# Altium schematic sheet [10] - DOC REVISION HISTORY.SchDoc
size A3; DocumentNumber: 10; SheetNumber: 10; SheetTotal: 11
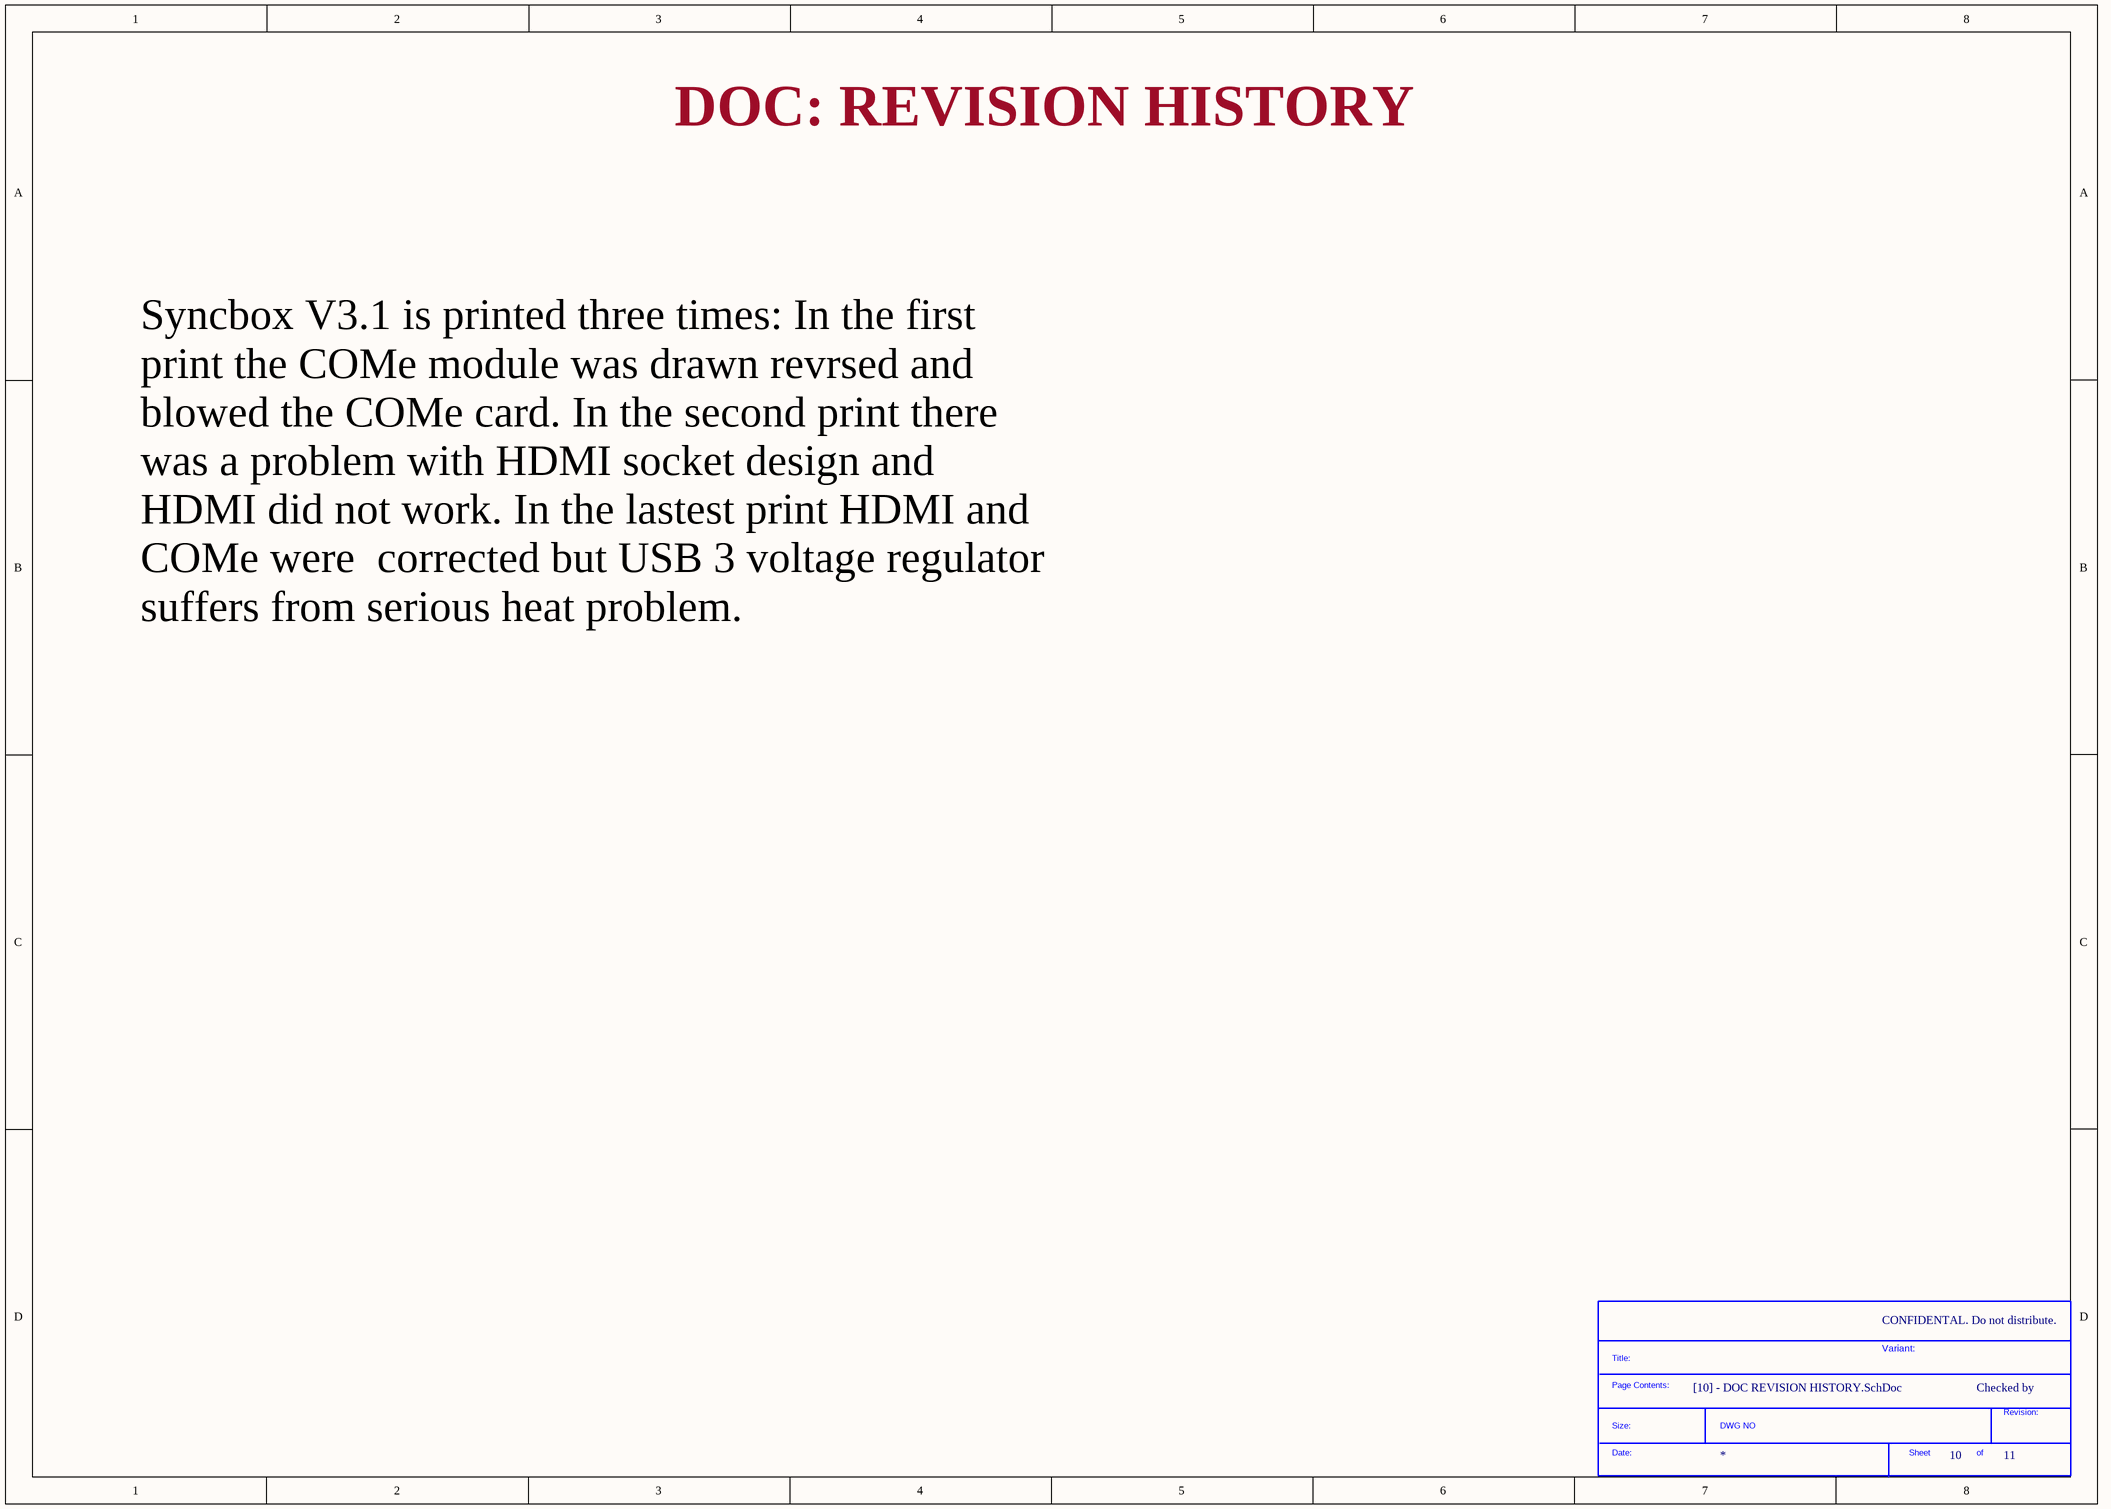
[diagram p0: [10] - DOC REVISION HISTORY.SchDoc]

## Parts
*  SDTitleBlock  (value not drawn)  (graphical)

## Notes on the sheet
- DOC: REVISION HISTORY
- Syncbox V3.1 is printed three times: In the first print the COMe module was drawn revrsed and blowed the COMe card. In the second print there was a problem with HDMI socket design and HDMI did not work. In the lastest print HDMI and COMe were  corrected but USB 3 voltage regulator suffers from serious heat problem.
- CONFIDENTAL. Do not distribute.
- CLOCKS (CPU & PCIE)
- Variant:
- Checked by
- (in symbol SDTitleBlock) Title:; Page Contents:; Revision:; Size:; DWG NO; Date:; Sheet; of